# EAGLE design HID2JOY (EAGLE 7.7.0)
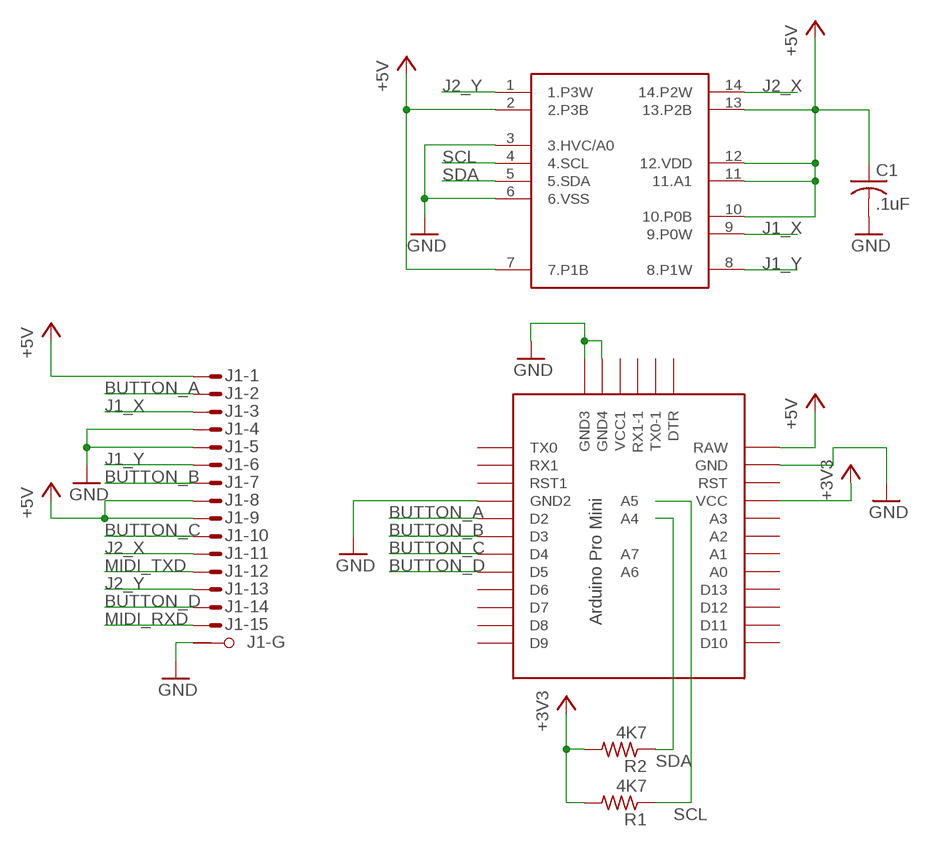
[diagram p0: schematic, sheet 1]

## Parts
C1  .1uF  C-USC0603  [C0603]
J1  M15HPS  [M15HP]
R1  4K7  R-US_R0603  [R0603]
R2  4K7  R-US_R0603  [R0603]
U1  PCM44X2TSSOP  [TSSOP14]
U$1  PRO-MINI-2  [PRO-MINI-2]

## Nets
+3V3: R1.2 R2.2 U$1.VCC
+5V: C1.1 J1.1(-1:M) J1.8(-8:M) J1.9(-9:M) U1.2(2.P3B) U1.7(7.P1B) U1.10(10.P0B) U1.11(11.A1) U1.12(12.VDD) U1.13(13.P2B) U$1.RAW
BUTTON_A: J1.2(-2:M) U$1.D2
BUTTON_B: J1.7(-7:M) U$1.D3
BUTTON_C: J1.10(-10:M) U$1.D4
BUTTON_D: J1.14(-14:M) U$1.D5
GND: C1.2 J1.4(-4:M) J1.5(-5:M) J1.G1(-G:G1) U1.3(3.HVC/A0) U1.6(6.VSS) U$1.GND U$1.GND1(GND2) U$1.GND2(GND3) U$1.GND3(GND4)
J1_X: J1.3(-3:M) U1.9(9.P0W)
J1_Y: J1.6(-6:M) U1.8(8.P1W)
J2_X: J1.11(-11:M) U1.14(14.P2W)
J2_Y: J1.13(-13:M) U1.1(1.P3W)
MIDI_RXD: J1.15(-15:M)
MIDI_TXD: J1.12(-12:M)
SCL: R1.1 U1.4(4.SCL) U$1.A5
SDA: R2.1 U1.5(5.SDA) U$1.A4
Unconnected: J1.G2(-G:G2) U$1.A0 U$1.A1 U$1.A2 U$1.A3 U$1.A6 U$1.A7 U$1.D6 U$1.D7 U$1.D8 U$1.D9 U$1.D10 U$1.D11 U$1.D12 U$1.D13 U$1.DTR U$1.RST U$1.RST1 U$1.RX1 U$1.RX1-1 U$1.TX0 U$1.TX0-1 U$1.VCC1

## Library data of the parts
C1 = HID2JOY:C-US: CAPACITOR, American symbol
J1 = HID2JOY:M15HPS: SUB-D; OC_FARNELL: unknown; OC_NEWARK: unknown
R1 R2 = HID2JOY:R-US_: RESISTOR, American symbol
U1 = HID2JOY:PCM44X2
U$1 = Arduino-clone:PRO-MINI-2: Arduino Pro Mini Layout 2 Sparkfun.com

## Board
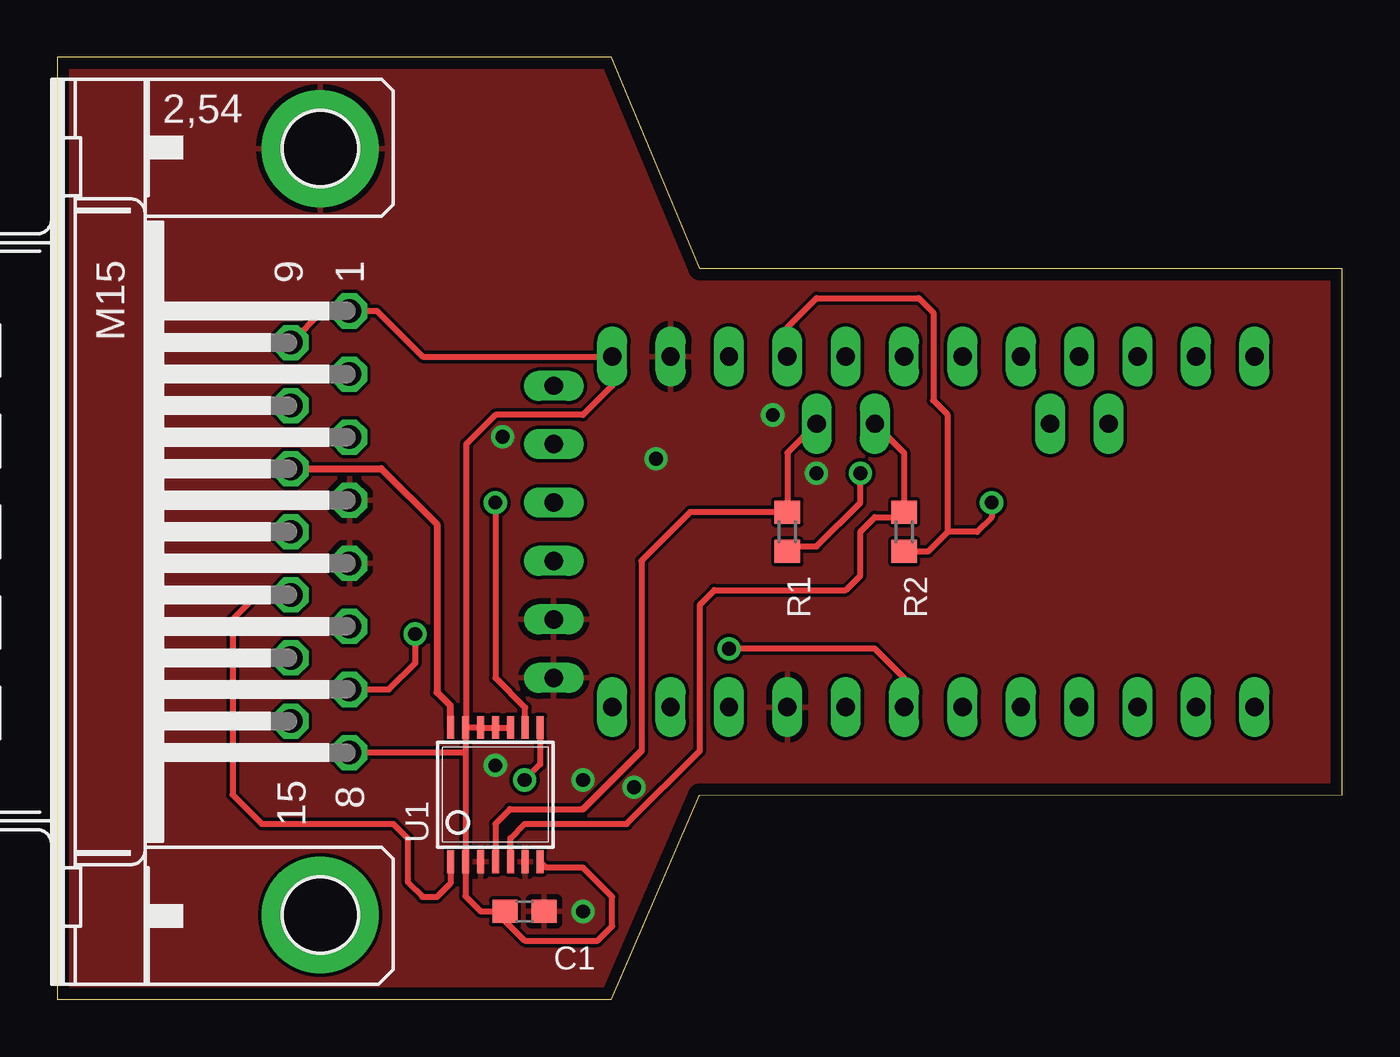
[diagram p1: board, top side]
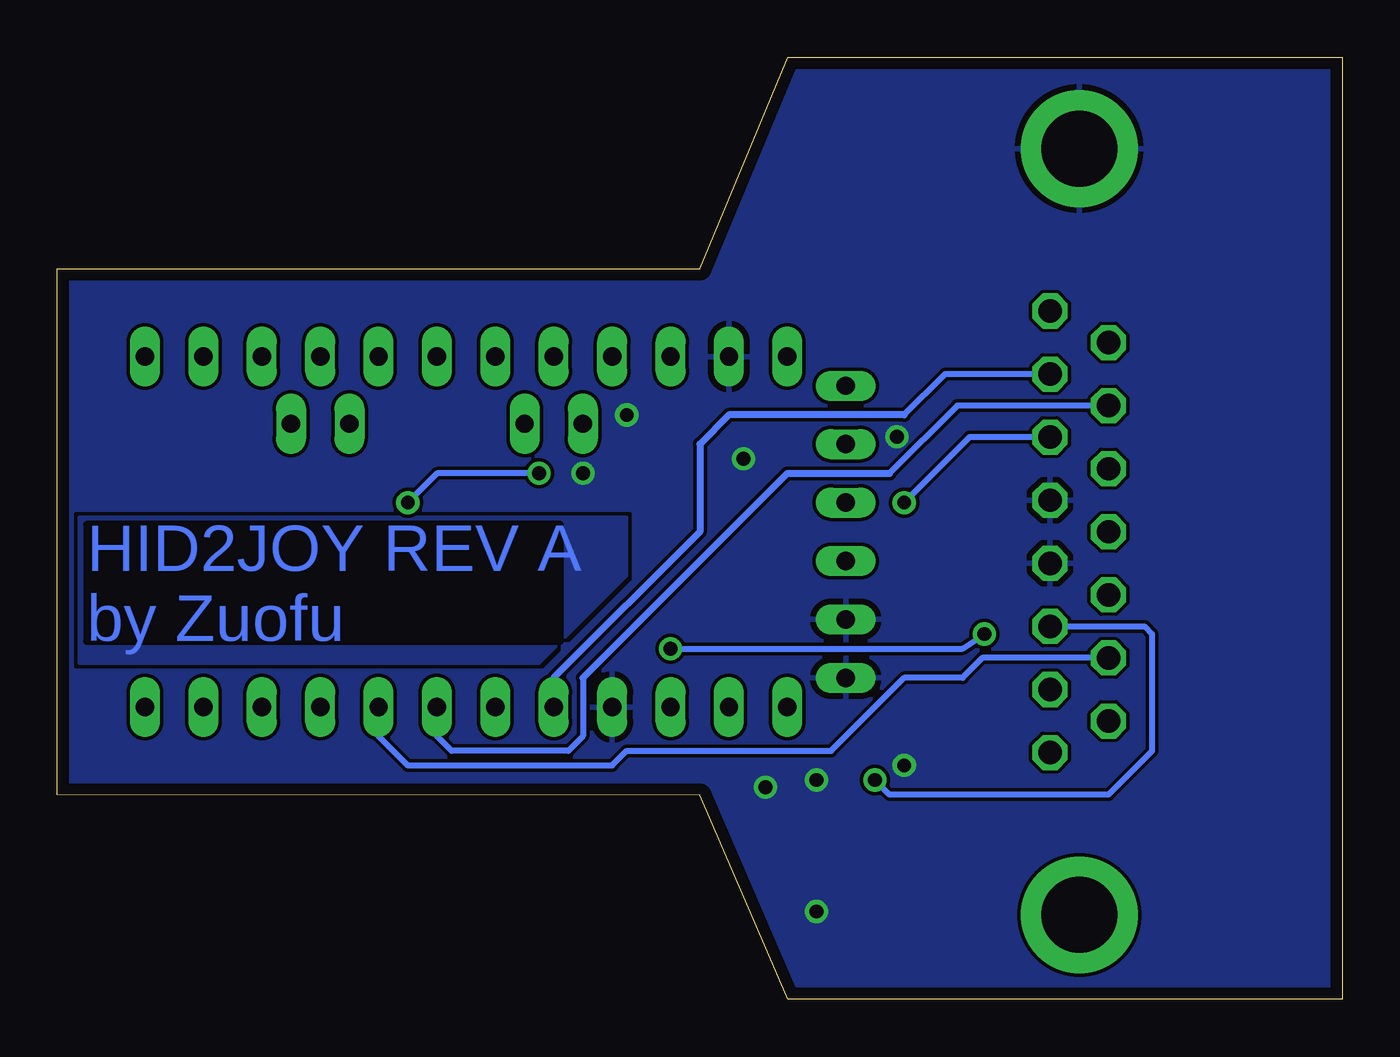
[diagram p2: board, bottom side, seen from below]

Size 55.88 x 40.95 mm. Coordinates in mm from the lower left corner, seen from the top.
Outline: 0,0 24.11,0 27.92,8.87 55.88,8.89 55.88,31.75 27.94,31.75 24.11,40.95 0,40.95 0,0
Copper layers (1*16): Top 0.035mm / dielectric 1.5mm / Bottom 0.035mm
Design rules "default *": minimum track width 6mil, minimum drill 20mil, track to track 6mil, track to pad 6mil, pad to pad 6mil, via to via 6mil, smd to smd 6mil, copper to edge 20mil, drill to drill 8mil, minimum pad ring 10mil, minimum via ring 8mil, stop-mask expansion 4mil, vias tented up to drill 0mil, thermal gap 10mil

### Footprints (pad centres in the part's own frame; a part is rotated, then mirrored left to right if it is on the bottom)
C0603 = smd 1.1 x 1: 1 -0.85,0; 2 0.85,0
M15HP = drill 1.016 octagon: 1 -9.601,1.27; 2 -6.858,1.27; 3 -4.115,1.27; 4 -1.372,1.27; 5 1.372,1.27; 6 4.115,1.27; 7 6.858,1.27; 8 9.601,1.27; 9 -8.23,-1.27; 10 -5.486,-1.27; 11 -2.743,-1.27; 12 0,-1.27; 13 2.743,-1.27; 14 5.486,-1.27; 15 8.23,-1.27 | drill 3.302 pad 5.08: G1 -16.662,0; G2 16.662,0
R0603 = smd 1 x 1.1: 1 -0.85,0; 2 0.85,0
TSSOP14 = smd 0.305 x 0.991: 1 -1.95,-2.918; 2 -1.3,-2.918; 3 -0.65,-2.918; 4 0,-2.918; 5 0.65,-2.918; 6 1.3,-2.918; 7 1.95,-2.918; 8 1.95,2.918; 9 1.3,2.918; 10 0.65,2.918; 11 0,2.918; 12 -0.65,2.918; 13 -1.3,2.918; 14 -1.95,2.918
PRO-MINI-2 = drill 0.8 long: A0 6.35,2.54; A1 6.35,0; A2 6.35,-2.54; A3 6.35,-5.08; A4 3.429,1.27; A5 3.429,3.81; A6 3.429,-8.89; A7 3.429,-6.35; D2 -8.89,2.54; D3 -8.89,0; D4 -8.89,-2.54; D5 -8.89,-5.08; D6 -8.89,-7.62; D7 -8.89,-10.16; D8 -8.89,-12.7; D9 -8.89,-15.24; D10 6.35,-15.24; D11 6.35,-12.7; D12 6.35,-10.16; D13 6.35,-7.62; DTR 5.08,15.24; GND 6.35,10.16; GND1 -8.89,5.08; GND2 -7.62,15.24; GND3 -5.08,15.24; RAW 6.35,12.7; RST 6.35,7.62; RST1 -8.89,7.62; RX1 -8.89,10.16; RX1-1 0,15.24; TX0 -8.89,12.7; TX0-1 2.54,15.24; VCC 6.35,5.08; VCC1 -2.54,15.24

### Placement (x,y rotation side)
C1  20.32,3.81 0 top
J1  11.43,20.32 270 top
R1  31.75,20.32 270 top
R2  36.83,20.32 270 top
U1  19.05,8.89 0 top
U$1  36.83,21.59 90 top

### Tracks (layer width: path | path; a pad name or v marks a point on that pad's centre or on a via)
+3V3  (via drill 0.6)
  Top 0.254: R1.2 31.96,19.68 33.02,19.68 34.92,21.59 v34.92,22.86 | R2.2 37.88,19.47 38.73,20.32 | 38.73,20.32 38.73,25.4 38.1,26.04 38.1,29.84 37.47,30.48 33.02,30.48 31.75,29.21 U$1.VCC | v40.64,21.59 40.64,20.95 40.01,20.32 38.73,20.32
  Bottom 0.254: v34.92,22.86 39.37,22.86 v40.64,21.59
+5V
  Top 0.254: U1.13 17.78,11.84 17.78,24.13 19.05,25.4 22.86,25.4 24.13,26.67 U$1.RAW 15.88,27.94 13.89,29.92 J1.1 11.53,29.92 J1.9 | U1.10 U1.11 U1.12 U1.13 | U1.13 17.75,10.79 | 17.75,10.79 U1.2 17.75,4.47 18.41,3.81 C1.1 19.47,3.39 20.32,2.54 23.5,2.54 24.13,3.17 24.13,4.45 22.86,5.71 21.26,5.71 U1.7 | 17.75,10.79 17.67,10.72 J1.8
BUTTON_A
  Bottom 0.254: J1.2 17.27,27.18 19.05,25.4
  Bottom 0.305: 19.05,25.4 26.67,25.4 27.94,24.13 27.94,20.32 34.29,13.97 U$1.D2
BUTTON_B  (via drill 0.6)
  Top 0.254: U$1.D3 36.83,13.97 35.56,15.24 v29.21,15.24 | v15.56,15.88 15.56,14.61 14.41,13.46 J1.7
  Bottom 0.254: v29.21,15.24 16.51,15.24 v15.56,15.88
BUTTON_C
  Bottom 0.254: J1.10 16.74,25.81 19.68,22.86 | U$1.D4 39.37,11.43 38.73,10.79 33.66,10.79 33.02,11.43 33.02,13.97
  Bottom 0.305: 33.02,13.97 24.13,22.86 19.68,22.86
BUTTON_D
  Bottom 0.254: U$1.D5 41.91,11.43 40.64,10.16 31.75,10.16 31.11,10.79 22.23,10.79 19.05,13.97 16.51,13.97 15.65,14.83 J1.14
GND  (via drill 0.6)
  other vias: 22.86,3.81 31.11,25.4 25.08,9.21 22.86,9.53 26.04,23.5 19.05,10.16 33.02,22.86 19.37,24.45
  pour Bottom (rank 2): -7.62,44.45 -7.62,-3.81 62.23,-3.81 62.23,44.45
  pour Top: -8.89,43.18 -8.89,-5.08 66.04,-5.08 64.77,43.18
J1_X  (via drill 0.6)
  Top 0.254: v19.05,21.59 19.05,13.97 20.35,12.67 U1.9
  Bottom 0.254: J1.3 16.2,24.43 v19.05,21.59
J1_Y  (via drill 0.6)
  Top 0.254: U1.8 21,10.21 v20.32,9.53
  Bottom 0.254: J1.6 8.59,16.2 8.26,15.88 8.26,10.79 10.16,8.89 19.68,8.89 v20.32,9.53
J2_X
  Top 0.305: J1.11 14.08,23.06 16.51,20.64 16.51,13.34 17.1,12.74 U1.14
J2_Y
  Top 0.254: J1.13 8.69,17.58 7.62,16.51 7.62,8.89 8.89,7.62 14.61,7.62 15.24,6.99 15.24,5.08 15.88,4.45 16.51,4.45 17.1,5.04 U1.1
N$1
  pour Bottom: 31.11,20.95 31.11,18.41 34.92,14.61 54.93,14.61 54.93,20.95
SCL
  Top 0.254: 19.05,6.35 U1.4 19.05,7.62 19.68,8.26 22.86,8.26 | 25.4,10.79 25.4,19.05 27.52,21.17 R1.1 31.75,23.75 U$1.A5
  Top 0.305: 25.4,10.79 22.86,8.26
SDA
  Top 0.254: U1.5 19.7,7 20.32,7.62 24.77,7.62 27.94,10.79 27.94,17.14 28.57,17.78 34.29,17.78 34.92,18.41 34.92,20.32 35.56,20.95 36.62,20.95 R2.1 36.83,23.75 U$1.A4

### Text on the board
Bottom: HID2JOY REV A / by Zuofu